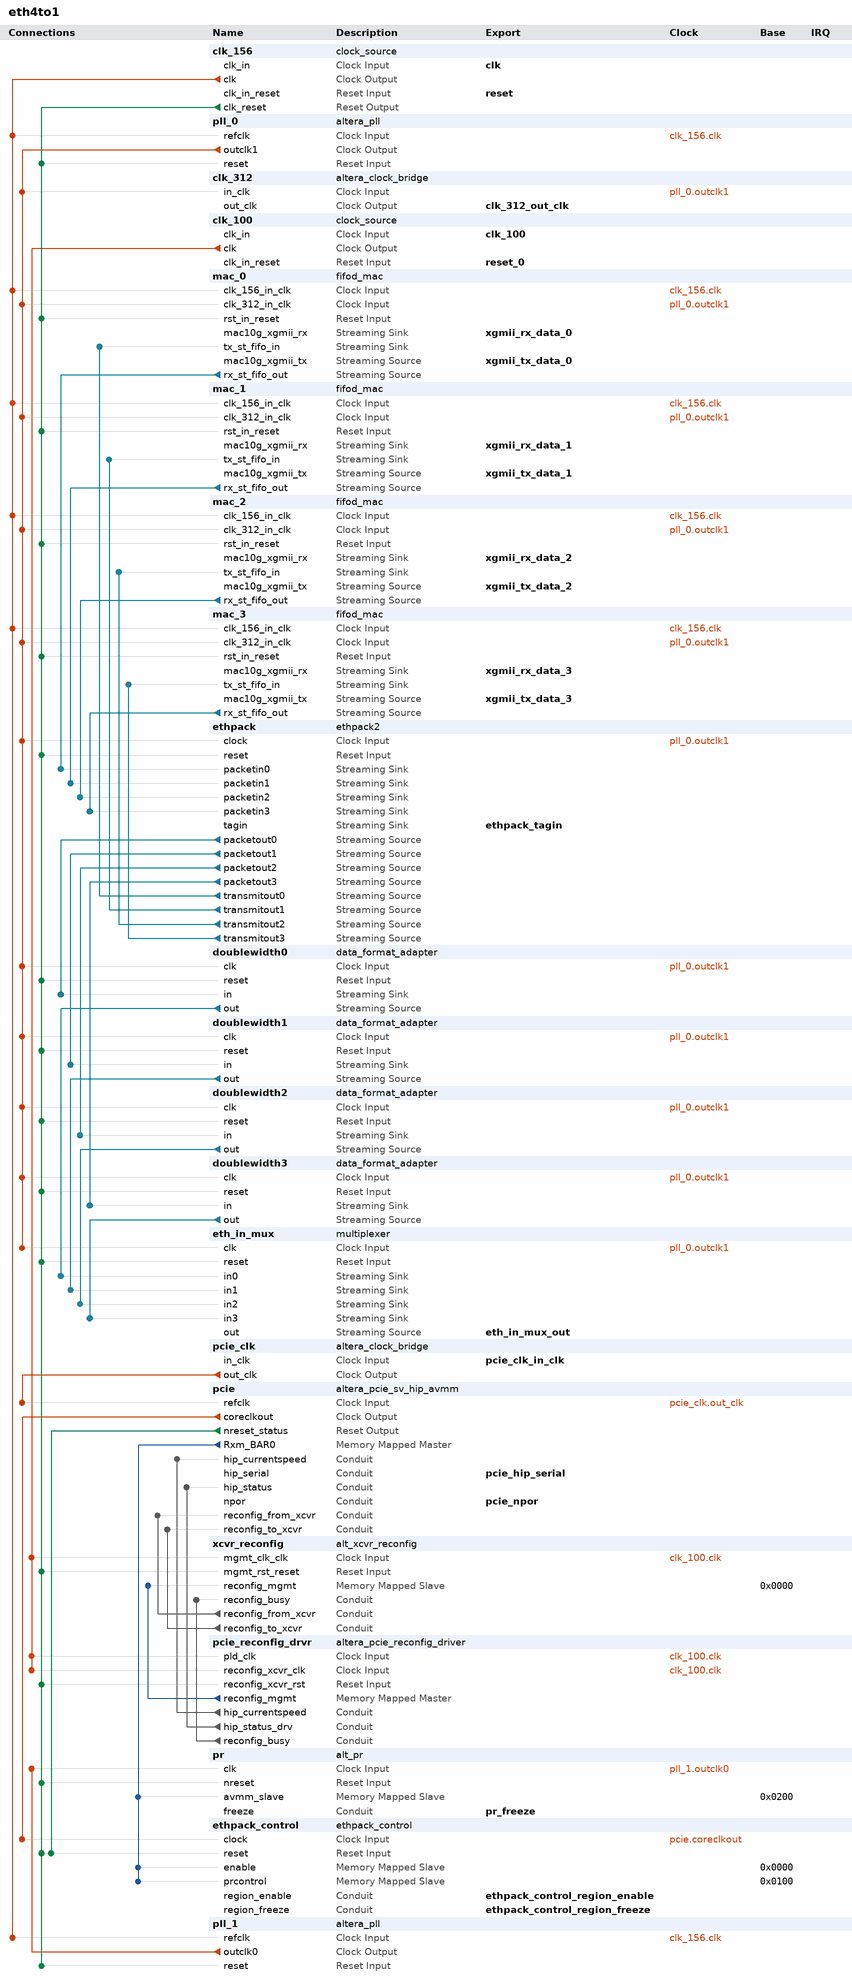
[diagram p0: system contents]
# Platform Designer (Qsys) system eth4to1, Stratix V 5SGXEA7N2F45C2
# Parameters at their usual value, and those the tool derives, are not listed.
package require -exact qsys 16.1
create_system eth4to1
set_project_property DEVICE_FAMILY {Stratix V}
set_project_property DEVICE 5SGXEA7N2F45C2

add_instance clk_156 clock_source 16.1
set_instance_parameter_value clk_156 clockFrequency 156250000

add_instance pll_0 altera_pll 16.1
set_instance_parameter_value pll_0 gui_actual_output_clock_frequency0 {262.910227 MHz}
set_instance_parameter_value pll_0 gui_actual_output_clock_frequency1 {260.416666 MHz}
set_instance_parameter_value pll_0 gui_device_speed_grade 1
set_instance_parameter_value pll_0 gui_number_of_clocks 2
set_instance_parameter_value pll_0 gui_operation_mode direct
set_instance_parameter_value pll_0 gui_output_clock_frequency0 312.5
set_instance_parameter_value pll_0 gui_output_clock_frequency1 260.416666
set_instance_parameter_value pll_0 gui_pll_auto_reset On
set_instance_parameter_value pll_0 gui_pll_mode {Integer-N PLL}
set_instance_parameter_value pll_0 gui_reference_clock_frequency 156.25
set_instance_parameter_value pll_0 gui_use_locked false

add_instance clk_312 altera_clock_bridge 16.1
set_instance_parameter_value clk_312 DERIVED_CLOCK_RATE 260416666
set_instance_parameter_value clk_312 EXPLICIT_CLOCK_RATE 312500000

add_instance clk_100 clock_source 16.1
set_instance_parameter_value clk_100 clockFrequency 100000000

add_instance mac_0 fifod_mac 1.0

add_instance mac_1 fifod_mac 1.0

add_instance mac_2 fifod_mac 1.0

add_instance mac_3 fifod_mac 1.0

add_instance ethpack ethpack2 1.1

add_instance doublewidth0 data_format_adapter 16.1
set_instance_parameter_value doublewidth0 inBitsPerSymbol 74
set_instance_parameter_value doublewidth0 inChannelWidth 0
set_instance_parameter_value doublewidth0 inErrorWidth 0
set_instance_parameter_value doublewidth0 inMaxChannel 0
set_instance_parameter_value doublewidth0 inReadyLatency 0
set_instance_parameter_value doublewidth0 inSymbolsPerBeat 1
set_instance_parameter_value doublewidth0 inUseEmpty false
set_instance_parameter_value doublewidth0 inUseEmptyPort AUTO
set_instance_parameter_value doublewidth0 inUsePackets true
set_instance_parameter_value doublewidth0 outSymbolsPerBeat 2
set_instance_parameter_value doublewidth0 outUseEmpty false
set_instance_parameter_value doublewidth0 outUseEmptyPort AUTO

add_instance doublewidth1 data_format_adapter 16.1
set_instance_parameter_value doublewidth1 inBitsPerSymbol 74
set_instance_parameter_value doublewidth1 inChannelWidth 0
set_instance_parameter_value doublewidth1 inErrorWidth 0
set_instance_parameter_value doublewidth1 inMaxChannel 0
set_instance_parameter_value doublewidth1 inReadyLatency 0
set_instance_parameter_value doublewidth1 inSymbolsPerBeat 1
set_instance_parameter_value doublewidth1 inUseEmpty false
set_instance_parameter_value doublewidth1 inUseEmptyPort AUTO
set_instance_parameter_value doublewidth1 inUsePackets true
set_instance_parameter_value doublewidth1 outSymbolsPerBeat 2
set_instance_parameter_value doublewidth1 outUseEmpty false
set_instance_parameter_value doublewidth1 outUseEmptyPort AUTO

add_instance doublewidth2 data_format_adapter 16.1
set_instance_parameter_value doublewidth2 inBitsPerSymbol 74
set_instance_parameter_value doublewidth2 inChannelWidth 0
set_instance_parameter_value doublewidth2 inErrorWidth 0
set_instance_parameter_value doublewidth2 inMaxChannel 0
set_instance_parameter_value doublewidth2 inReadyLatency 0
set_instance_parameter_value doublewidth2 inSymbolsPerBeat 1
set_instance_parameter_value doublewidth2 inUseEmpty false
set_instance_parameter_value doublewidth2 inUseEmptyPort AUTO
set_instance_parameter_value doublewidth2 inUsePackets true
set_instance_parameter_value doublewidth2 outSymbolsPerBeat 2
set_instance_parameter_value doublewidth2 outUseEmpty false
set_instance_parameter_value doublewidth2 outUseEmptyPort AUTO

add_instance doublewidth3 data_format_adapter 16.1
set_instance_parameter_value doublewidth3 inBitsPerSymbol 74
set_instance_parameter_value doublewidth3 inChannelWidth 0
set_instance_parameter_value doublewidth3 inErrorWidth 0
set_instance_parameter_value doublewidth3 inMaxChannel 0
set_instance_parameter_value doublewidth3 inReadyLatency 0
set_instance_parameter_value doublewidth3 inSymbolsPerBeat 1
set_instance_parameter_value doublewidth3 inUseEmpty false
set_instance_parameter_value doublewidth3 inUseEmptyPort AUTO
set_instance_parameter_value doublewidth3 inUsePackets true
set_instance_parameter_value doublewidth3 outSymbolsPerBeat 2
set_instance_parameter_value doublewidth3 outUseEmpty false
set_instance_parameter_value doublewidth3 outUseEmptyPort AUTO

add_instance eth_in_mux multiplexer 16.1
set_instance_parameter_value eth_in_mux bitsPerSymbol 74
set_instance_parameter_value eth_in_mux errorWidth 0
set_instance_parameter_value eth_in_mux numInputInterfaces 4
set_instance_parameter_value eth_in_mux outChannelWidth 2
set_instance_parameter_value eth_in_mux packetScheduling true
set_instance_parameter_value eth_in_mux schedulingSize 2
set_instance_parameter_value eth_in_mux symbolsPerBeat 2
set_instance_parameter_value eth_in_mux useHighBitsOfChannel true
set_instance_parameter_value eth_in_mux usePackets true

add_instance pcie_clk altera_clock_bridge 16.1
set_instance_parameter_value pcie_clk DERIVED_CLOCK_RATE 0
set_instance_parameter_value pcie_clk EXPLICIT_CLOCK_RATE 100000000

add_instance pcie altera_pcie_sv_hip_avmm 16.1
set_instance_parameter_value pcie AST_LITE 0
set_instance_parameter_value pcie AVALON_ADDR_WIDTH 32
set_instance_parameter_value pcie AddressPage "0\\,1\\,2\\,3\\,4\\,5\\,6\\,7\\,8\\,9\\,10\\,11\\,12\\,13\\,14\\,15"
set_instance_parameter_value pcie BYPASSS_A2P_TRANSLATION 0
set_instance_parameter_value pcie CB_A2P_ADDR_MAP_FIXED_TABLE_0_HIGH 0
set_instance_parameter_value pcie CB_A2P_ADDR_MAP_FIXED_TABLE_0_LOW 0
set_instance_parameter_value pcie CB_A2P_ADDR_MAP_FIXED_TABLE_10_HIGH 0
set_instance_parameter_value pcie CB_A2P_ADDR_MAP_FIXED_TABLE_10_LOW 0
set_instance_parameter_value pcie CB_A2P_ADDR_MAP_FIXED_TABLE_11_HIGH 0
set_instance_parameter_value pcie CB_A2P_ADDR_MAP_FIXED_TABLE_11_LOW 0
set_instance_parameter_value pcie CB_A2P_ADDR_MAP_FIXED_TABLE_12_HIGH 0
set_instance_parameter_value pcie CB_A2P_ADDR_MAP_FIXED_TABLE_12_LOW 0
set_instance_parameter_value pcie CB_A2P_ADDR_MAP_FIXED_TABLE_13_HIGH 0
set_instance_parameter_value pcie CB_A2P_ADDR_MAP_FIXED_TABLE_13_LOW 0
set_instance_parameter_value pcie CB_A2P_ADDR_MAP_FIXED_TABLE_14_HIGH 0
set_instance_parameter_value pcie CB_A2P_ADDR_MAP_FIXED_TABLE_14_LOW 0
set_instance_parameter_value pcie CB_A2P_ADDR_MAP_FIXED_TABLE_15_HIGH 0
set_instance_parameter_value pcie CB_A2P_ADDR_MAP_FIXED_TABLE_15_LOW 0
set_instance_parameter_value pcie CB_A2P_ADDR_MAP_FIXED_TABLE_1_HIGH 0
set_instance_parameter_value pcie CB_A2P_ADDR_MAP_FIXED_TABLE_1_LOW 0
set_instance_parameter_value pcie CB_A2P_ADDR_MAP_FIXED_TABLE_2_HIGH 0
set_instance_parameter_value pcie CB_A2P_ADDR_MAP_FIXED_TABLE_2_LOW 0
set_instance_parameter_value pcie CB_A2P_ADDR_MAP_FIXED_TABLE_3_HIGH 0
set_instance_parameter_value pcie CB_A2P_ADDR_MAP_FIXED_TABLE_3_LOW 0
set_instance_parameter_value pcie CB_A2P_ADDR_MAP_FIXED_TABLE_4_HIGH 0
set_instance_parameter_value pcie CB_A2P_ADDR_MAP_FIXED_TABLE_4_LOW 0
set_instance_parameter_value pcie CB_A2P_ADDR_MAP_FIXED_TABLE_5_HIGH 0
set_instance_parameter_value pcie CB_A2P_ADDR_MAP_FIXED_TABLE_5_LOW 0
set_instance_parameter_value pcie CB_A2P_ADDR_MAP_FIXED_TABLE_6_HIGH 0
set_instance_parameter_value pcie CB_A2P_ADDR_MAP_FIXED_TABLE_6_LOW 0
set_instance_parameter_value pcie CB_A2P_ADDR_MAP_FIXED_TABLE_7_HIGH 0
set_instance_parameter_value pcie CB_A2P_ADDR_MAP_FIXED_TABLE_7_LOW 0
set_instance_parameter_value pcie CB_A2P_ADDR_MAP_FIXED_TABLE_8_HIGH 0
set_instance_parameter_value pcie CB_A2P_ADDR_MAP_FIXED_TABLE_8_LOW 0
set_instance_parameter_value pcie CB_A2P_ADDR_MAP_FIXED_TABLE_9_HIGH 0
set_instance_parameter_value pcie CB_A2P_ADDR_MAP_FIXED_TABLE_9_LOW 0
set_instance_parameter_value pcie CB_A2P_ADDR_MAP_IS_FIXED 0
set_instance_parameter_value pcie CB_A2P_ADDR_MAP_NUM_ENTRIES 2
set_instance_parameter_value pcie CB_A2P_ADDR_MAP_PASS_THRU_BITS 20
set_instance_parameter_value pcie CB_P2A_AVALON_ADDR_B0 0x00000000
set_instance_parameter_value pcie CB_P2A_AVALON_ADDR_B1 0x00000000
set_instance_parameter_value pcie CB_P2A_AVALON_ADDR_B2 0x00000000
set_instance_parameter_value pcie CB_P2A_AVALON_ADDR_B3 0x00000000
set_instance_parameter_value pcie CB_P2A_AVALON_ADDR_B4 0x00000000
set_instance_parameter_value pcie CB_P2A_AVALON_ADDR_B5 0x00000000
set_instance_parameter_value pcie CB_P2A_FIXED_AVALON_ADDR_B0 0
set_instance_parameter_value pcie CB_P2A_FIXED_AVALON_ADDR_B1 0
set_instance_parameter_value pcie CB_P2A_FIXED_AVALON_ADDR_B2 0
set_instance_parameter_value pcie CB_P2A_FIXED_AVALON_ADDR_B3 0
set_instance_parameter_value pcie CB_P2A_FIXED_AVALON_ADDR_B4 0
set_instance_parameter_value pcie CB_P2A_FIXED_AVALON_ADDR_B5 0
set_instance_parameter_value pcie CB_PCIE_MODE 0
set_instance_parameter_value pcie CB_PCIE_RX_LITE 0
set_instance_parameter_value pcie CB_RP_S_ADDR_WIDTH 32
set_instance_parameter_value pcie CG_COMMON_CLOCK_MODE 1
set_instance_parameter_value pcie CG_ENABLE_A2P_INTERRUPT 0
set_instance_parameter_value pcie CG_ENABLE_ADVANCED_INTERRUPT 0
set_instance_parameter_value pcie CG_ENABLE_HIP_STATUS 1
set_instance_parameter_value pcie CG_ENABLE_HIP_STATUS_EXTENSION 0
set_instance_parameter_value pcie CG_IMPL_CRA_AV_SLAVE_PORT 1
set_instance_parameter_value pcie CG_RXM_IRQ_NUM 16
set_instance_parameter_value pcie NUM_PREFETCH_MASTERS 1
set_instance_parameter_value pcie PCIeAddress31_0 "0x00000000\\,0x00000000\\,0x00000000\\,0x00000000\\,0x00000000\\,0x00000000\\,0x00000000\\,0x00000000\\,0x00000000\\,0x00000000\\,0x00000000\\,0x00000000\\,0x00000000\\,0x00000000\\,0x00000000\\,0x00000000"
set_instance_parameter_value pcie PCIeAddress63_32 "0x00000000\\,0x00000000\\,0x00000000\\,0x00000000\\,0x00000000\\,0x00000000\\,0x00000000\\,0x00000000\\,0x00000000\\,0x00000000\\,0x00000000\\,0x00000000\\,0x00000000\\,0x00000000\\,0x00000000\\,0x00000000"
set_instance_parameter_value pcie RXM_BEN_WIDTH 8
set_instance_parameter_value pcie RXM_DATA_WIDTH 64
set_instance_parameter_value pcie SLAVE_ADDRESS_MAP_0 10
set_instance_parameter_value pcie SLAVE_ADDRESS_MAP_1 0
set_instance_parameter_value pcie SLAVE_ADDRESS_MAP_2 0
set_instance_parameter_value pcie SLAVE_ADDRESS_MAP_3 0
set_instance_parameter_value pcie SLAVE_ADDRESS_MAP_4 0
set_instance_parameter_value pcie SLAVE_ADDRESS_MAP_5 0
set_instance_parameter_value pcie TX_S_ADDR_WIDTH 32
set_instance_parameter_value pcie advanced_default_hwtcl_atomic_malformed true
set_instance_parameter_value pcie advanced_default_hwtcl_atomic_op_completer_32bit false
set_instance_parameter_value pcie advanced_default_hwtcl_atomic_op_completer_64bit false
set_instance_parameter_value pcie advanced_default_hwtcl_atomic_op_routing false
set_instance_parameter_value pcie advanced_default_hwtcl_bridge_port_ssid_support false
set_instance_parameter_value pcie advanced_default_hwtcl_bridge_port_vga_enable false
set_instance_parameter_value pcie advanced_default_hwtcl_bypass_cdc false
set_instance_parameter_value pcie advanced_default_hwtcl_cas_completer_128bit false
set_instance_parameter_value pcie advanced_default_hwtcl_cdc_dummy_insert_limit 11
set_instance_parameter_value pcie advanced_default_hwtcl_d0_pme false
set_instance_parameter_value pcie advanced_default_hwtcl_d1_pme false
set_instance_parameter_value pcie advanced_default_hwtcl_d1_support false
set_instance_parameter_value pcie advanced_default_hwtcl_d2_pme false
set_instance_parameter_value pcie advanced_default_hwtcl_d2_support false
set_instance_parameter_value pcie advanced_default_hwtcl_d3_cold_pme false
set_instance_parameter_value pcie advanced_default_hwtcl_d3_hot_pme false
set_instance_parameter_value pcie advanced_default_hwtcl_data_pack_rx disable
set_instance_parameter_value pcie advanced_default_hwtcl_deskew_comma com_deskw
set_instance_parameter_value pcie advanced_default_hwtcl_device_number 0
set_instance_parameter_value pcie advanced_default_hwtcl_disable_link_x2_support false
set_instance_parameter_value pcie advanced_default_hwtcl_disable_snoop_packet false
set_instance_parameter_value pcie advanced_default_hwtcl_ei_delay_powerdown_count 10
set_instance_parameter_value pcie advanced_default_hwtcl_eie_before_nfts_count 4
set_instance_parameter_value pcie advanced_default_hwtcl_enable_adapter_half_rate_mode false
set_instance_parameter_value pcie advanced_default_hwtcl_enable_l1_aspm false
set_instance_parameter_value pcie advanced_default_hwtcl_enable_rx_buffer_checking false
set_instance_parameter_value pcie advanced_default_hwtcl_extended_format_field false
set_instance_parameter_value pcie advanced_default_hwtcl_extended_tag_reset false
set_instance_parameter_value pcie advanced_default_hwtcl_fc_init_timer 1024
set_instance_parameter_value pcie advanced_default_hwtcl_flow_control_timeout_count 200
set_instance_parameter_value pcie advanced_default_hwtcl_flow_control_update_count 30
set_instance_parameter_value pcie advanced_default_hwtcl_flr_capability false
set_instance_parameter_value pcie advanced_default_hwtcl_gen2_diffclock_nfts_count 255
set_instance_parameter_value pcie advanced_default_hwtcl_gen2_sameclock_nfts_count 255
set_instance_parameter_value pcie advanced_default_hwtcl_hot_plug_support 0
set_instance_parameter_value pcie advanced_default_hwtcl_interrupt_pin inta
set_instance_parameter_value pcie advanced_default_hwtcl_l01_entry_latency 31
set_instance_parameter_value pcie advanced_default_hwtcl_l0_exit_latency_diffclock 6
set_instance_parameter_value pcie advanced_default_hwtcl_l0_exit_latency_sameclock 6
set_instance_parameter_value pcie advanced_default_hwtcl_l1_exit_latency_diffclock 0
set_instance_parameter_value pcie advanced_default_hwtcl_l1_exit_latency_sameclock 0
set_instance_parameter_value pcie advanced_default_hwtcl_low_priority_vc single_vc
set_instance_parameter_value pcie advanced_default_hwtcl_ltr_mechanism false
set_instance_parameter_value pcie advanced_default_hwtcl_ltssm_1ms_timeout disable
set_instance_parameter_value pcie advanced_default_hwtcl_ltssm_freqlocked_check disable
set_instance_parameter_value pcie advanced_default_hwtcl_maximum_current 0
set_instance_parameter_value pcie advanced_default_hwtcl_no_command_completed false
set_instance_parameter_value pcie advanced_default_hwtcl_no_soft_reset false
set_instance_parameter_value pcie advanced_default_hwtcl_pclk_out_sel pclk
set_instance_parameter_value pcie advanced_default_hwtcl_pipex1_debug_sel disable
set_instance_parameter_value pcie advanced_default_hwtcl_register_pipe_signals false
set_instance_parameter_value pcie advanced_default_hwtcl_reserved_debug 0
set_instance_parameter_value pcie advanced_default_hwtcl_retry_buffer_last_active_address 2047
set_instance_parameter_value pcie advanced_default_hwtcl_rx_l0s_count_idl 0
set_instance_parameter_value pcie advanced_default_hwtcl_set_l0s 0
set_instance_parameter_value pcie advanced_default_hwtcl_skp_os_gen3_count 0
set_instance_parameter_value pcie advanced_default_hwtcl_skp_os_schedule_count 0
set_instance_parameter_value pcie advanced_default_hwtcl_ssid 0
set_instance_parameter_value pcie advanced_default_hwtcl_ssvid 0
set_instance_parameter_value pcie advanced_default_hwtcl_tph_completer false
set_instance_parameter_value pcie advanced_default_hwtcl_tx_cdc_almost_empty 5
set_instance_parameter_value pcie advanced_default_hwtcl_vc0_clk_enable true
set_instance_parameter_value pcie advanced_default_hwtcl_wrong_device_id disable
set_instance_parameter_value pcie advanced_default_parameter_override 0
set_instance_parameter_value pcie avmm_width_hwtcl 128
set_instance_parameter_value pcie bar0_type_hwtcl 1
set_instance_parameter_value pcie bar1_type_hwtcl 0
set_instance_parameter_value pcie bar2_type_hwtcl 1
set_instance_parameter_value pcie bar3_type_hwtcl 0
set_instance_parameter_value pcie bar4_type_hwtcl 0
set_instance_parameter_value pcie bar5_type_hwtcl 0
set_instance_parameter_value pcie bypass_tl false
set_instance_parameter_value pcie class_code_hwtcl 16711680
set_instance_parameter_value pcie completion_timeout_hwtcl ABCD
set_instance_parameter_value pcie device_id_hwtcl 57599
set_instance_parameter_value pcie dll_active_report_support_hwtcl 0
set_instance_parameter_value pcie ecrc_check_capable_hwtcl 0
set_instance_parameter_value pcie ecrc_gen_capable_hwtcl 0
set_instance_parameter_value pcie enable_completion_timeout_disable_hwtcl 1
set_instance_parameter_value pcie enable_function_msix_support_hwtcl 0
set_instance_parameter_value pcie enable_pcisigtest_hwtcl 0
set_instance_parameter_value pcie enable_power_on_rst_pulse_hwtcl 0
set_instance_parameter_value pcie enable_slot_register_hwtcl 0
set_instance_parameter_value pcie enable_tl_only_sim_hwtcl 0
set_instance_parameter_value pcie endpoint_l0_latency_hwtcl 0
set_instance_parameter_value pcie endpoint_l1_latency_hwtcl 0
set_instance_parameter_value pcie expansion_base_address_register_hwtcl 0
set_instance_parameter_value pcie extend_tag_field_hwtcl 32
set_instance_parameter_value pcie fixed_address_mode 0
set_instance_parameter_value pcie force_hrc 0
set_instance_parameter_value pcie force_src 0
set_instance_parameter_value pcie gen123_lane_rate_mode_hwtcl {Gen2 (5.0 Gbps)}
set_instance_parameter_value pcie gen3_rxfreqlock_counter_hwtcl 0
set_instance_parameter_value pcie hip_reconfig_hwtcl 0
set_instance_parameter_value pcie hip_tag_checking_hwtcl 1
set_instance_parameter_value pcie hwtcl_override_g2_txvod 1
set_instance_parameter_value pcie in_cvp_mode_hwtcl 0
set_instance_parameter_value pcie io_window_addr_width_hwtcl 0
set_instance_parameter_value pcie lane_mask_hwtcl x8
set_instance_parameter_value pcie max_payload_size_hwtcl 128
set_instance_parameter_value pcie msi_64bit_addressing_capable_hwtcl true
set_instance_parameter_value pcie msi_masking_capable_hwtcl false
set_instance_parameter_value pcie msi_multi_message_capable_hwtcl 4
set_instance_parameter_value pcie msi_support_hwtcl true
set_instance_parameter_value pcie msix_pba_bir_hwtcl 0
set_instance_parameter_value pcie msix_pba_offset_hwtcl 0
set_instance_parameter_value pcie msix_table_bir_hwtcl 0
set_instance_parameter_value pcie msix_table_offset_hwtcl 0
set_instance_parameter_value pcie msix_table_size_hwtcl 0
set_instance_parameter_value pcie override_rxbuffer_cred_preset 0
set_instance_parameter_value pcie override_tbpartner_driver_setting_hwtcl 0
set_instance_parameter_value pcie pcie_inspector_hwtcl 0
set_instance_parameter_value pcie pcie_qsys 1
set_instance_parameter_value pcie pll_refclk_freq_hwtcl {100 MHz}
set_instance_parameter_value pcie port_link_number_hwtcl 1
set_instance_parameter_value pcie port_type_hwtcl {Native endpoint}
set_instance_parameter_value pcie prefetchable_mem_window_addr_width_hwtcl 0
set_instance_parameter_value pcie revision_id_hwtcl 1
set_instance_parameter_value pcie rpre_emph_a_val_hwtcl 9
set_instance_parameter_value pcie rpre_emph_b_val_hwtcl 0
set_instance_parameter_value pcie rpre_emph_c_val_hwtcl 16
set_instance_parameter_value pcie rpre_emph_d_val_hwtcl 13
set_instance_parameter_value pcie rpre_emph_e_val_hwtcl 5
set_instance_parameter_value pcie rvod_sel_a_val_hwtcl 42
set_instance_parameter_value pcie rvod_sel_b_val_hwtcl 38
set_instance_parameter_value pcie rvod_sel_c_val_hwtcl 38
set_instance_parameter_value pcie rvod_sel_d_val_hwtcl 43
set_instance_parameter_value pcie rvod_sel_e_val_hwtcl 15
set_instance_parameter_value pcie rxbuffer_rxreq_hwtcl Low
set_instance_parameter_value pcie serial_sim_hwtcl 1
set_instance_parameter_value pcie set_pld_clk_x1_625MHz_hwtcl 0
set_instance_parameter_value pcie slot_number_hwtcl 0
set_instance_parameter_value pcie slot_power_limit_hwtcl 0
set_instance_parameter_value pcie slot_power_scale_hwtcl 0
set_instance_parameter_value pcie slotclkcfg_hwtcl 1
set_instance_parameter_value pcie subsystem_device_id_hwtcl 57599
set_instance_parameter_value pcie subsystem_vendor_id_hwtcl 4466
set_instance_parameter_value pcie surprise_down_error_support_hwtcl 0
set_instance_parameter_value pcie tlp_insp_trg_dw0_hwtcl 2049
set_instance_parameter_value pcie tlp_insp_trg_dw1_hwtcl 0
set_instance_parameter_value pcie tlp_insp_trg_dw2_hwtcl 0
set_instance_parameter_value pcie tlp_insp_trg_dw3_hwtcl 0
set_instance_parameter_value pcie tlp_inspector_hwtcl 0
set_instance_parameter_value pcie tlp_inspector_use_signal_probe_hwtcl 0
set_instance_parameter_value pcie use_aer_hwtcl 0
set_instance_parameter_value pcie use_ast_parity 0
set_instance_parameter_value pcie use_atx_pll_hwtcl 0
set_instance_parameter_value pcie use_crc_forwarding_hwtcl 0
set_instance_parameter_value pcie use_cvp_update_core_pof_hwtcl 0
set_instance_parameter_value pcie use_rx_st_be_hwtcl 0
set_instance_parameter_value pcie user_id_hwtcl 0
set_instance_parameter_value pcie vendor_id_hwtcl 4466
set_instance_parameter_value pcie vsec_id_hwtcl 4466
set_instance_parameter_value pcie vsec_rev_hwtcl 0

add_instance xcvr_reconfig alt_xcvr_reconfig 16.1
set_instance_parameter_value xcvr_reconfig device_family {Stratix V}
set_instance_parameter_value xcvr_reconfig enable_adce 0
set_instance_parameter_value xcvr_reconfig enable_analog 1
set_instance_parameter_value xcvr_reconfig number_of_reconfig_interfaces 10

add_instance pcie_reconfig_drvr altera_pcie_reconfig_driver 16.1
set_instance_parameter_value pcie_reconfig_drvr gen123_lane_rate_mode_hwtcl {Gen3 (8.0 Gbps)}
set_instance_parameter_value pcie_reconfig_drvr number_of_reconfig_interfaces 11

add_instance pr alt_pr 16.1
set_instance_parameter_value pr CDRATIO 1
set_instance_parameter_value pr DATA_WIDTH_INDEX 32
set_instance_parameter_value pr EDCRC_OSC_DIVIDER 1
set_instance_parameter_value pr ENABLE_AVMM_SLAVE true
set_instance_parameter_value pr ENABLE_ENHANCED_DECOMPRESSION false
set_instance_parameter_value pr ENABLE_INTERRUPT false
set_instance_parameter_value pr ENABLE_JTAG true
set_instance_parameter_value pr ENABLE_PRPOF_ID_CHECK_UI false
set_instance_parameter_value pr EXT_HOST_PRPOF_ID 0
set_instance_parameter_value pr EXT_HOST_TARGET_DEVICE_FAMILY {Stratix V}
set_instance_parameter_value pr GENERATE_SDC true
set_instance_parameter_value pr INSTANTIATE_CRC_BLOCK true
set_instance_parameter_value pr INSTANTIATE_PR_BLOCK true
set_instance_parameter_value pr PR_INTERNAL_HOST true

add_instance ethpack_control ethpack_control 1.0
set_instance_parameter_value ethpack_control REGIONDEFAULT 3

add_instance pll_1 altera_pll 16.1
set_instance_parameter_value pll_1 gui_actual_output_clock_frequency0 {99.997368 MHz}
set_instance_parameter_value pll_1 gui_device_speed_grade 1
set_instance_parameter_value pll_1 gui_number_of_clocks 1
set_instance_parameter_value pll_1 gui_operation_mode direct
set_instance_parameter_value pll_1 gui_output_clock_frequency0 100.0
set_instance_parameter_value pll_1 gui_pll_mode {Integer-N PLL}
set_instance_parameter_value pll_1 gui_reference_clock_frequency 156.25
set_instance_parameter_value pll_1 gui_use_locked false

# connections
add_connection clk_100.clk pcie_reconfig_drvr.pld_clk clock
add_connection clk_100.clk pcie_reconfig_drvr.reconfig_xcvr_clk clock
add_connection clk_100.clk xcvr_reconfig.mgmt_clk_clk clock
add_connection clk_156.clk mac_0.clk_156_in_clk clock
add_connection clk_156.clk mac_1.clk_156_in_clk clock
add_connection clk_156.clk mac_2.clk_156_in_clk clock
add_connection clk_156.clk mac_3.clk_156_in_clk clock
add_connection clk_156.clk pll_0.refclk clock
add_connection clk_156.clk pll_1.refclk clock
add_connection pcie.coreclkout ethpack_control.clock clock
add_connection pcie_clk.out_clk pcie.refclk clock
add_connection pll_0.outclk1 clk_312.in_clk clock
add_connection pll_0.outclk1 doublewidth0.clk clock
add_connection pll_0.outclk1 doublewidth1.clk clock
add_connection pll_0.outclk1 doublewidth2.clk clock
add_connection pll_0.outclk1 doublewidth3.clk clock
add_connection pll_0.outclk1 eth_in_mux.clk clock
add_connection pll_0.outclk1 ethpack.clock clock
add_connection pll_0.outclk1 mac_0.clk_312_in_clk clock
add_connection pll_0.outclk1 mac_1.clk_312_in_clk clock
add_connection pll_0.outclk1 mac_2.clk_312_in_clk clock
add_connection pll_0.outclk1 mac_3.clk_312_in_clk clock
add_connection pll_1.outclk0 pr.clk clock
add_connection clk_156.clk_reset doublewidth0.reset reset
add_connection clk_156.clk_reset doublewidth1.reset reset
add_connection clk_156.clk_reset doublewidth2.reset reset
add_connection clk_156.clk_reset doublewidth3.reset reset
add_connection clk_156.clk_reset eth_in_mux.reset reset
add_connection clk_156.clk_reset ethpack.reset reset
add_connection clk_156.clk_reset ethpack_control.reset reset
add_connection clk_156.clk_reset mac_0.rst_in_reset reset
add_connection clk_156.clk_reset mac_1.rst_in_reset reset
add_connection clk_156.clk_reset mac_2.rst_in_reset reset
add_connection clk_156.clk_reset mac_3.rst_in_reset reset
add_connection clk_156.clk_reset pcie_reconfig_drvr.reconfig_xcvr_rst reset
add_connection clk_156.clk_reset pll_0.reset reset
add_connection clk_156.clk_reset pll_1.reset reset
add_connection clk_156.clk_reset pr.nreset reset
add_connection clk_156.clk_reset xcvr_reconfig.mgmt_rst_reset reset
add_connection pcie.nreset_status ethpack_control.reset reset
add_connection pcie.Rxm_BAR0 ethpack_control.enable avalon
set_connection_parameter_value pcie.Rxm_BAR0/ethpack_control.enable baseAddress 0x0000
add_connection pcie.Rxm_BAR0 ethpack_control.prcontrol avalon
set_connection_parameter_value pcie.Rxm_BAR0/ethpack_control.prcontrol baseAddress 0x0100
add_connection pcie.Rxm_BAR0 pr.avmm_slave avalon
set_connection_parameter_value pcie.Rxm_BAR0/pr.avmm_slave baseAddress 0x0200
add_connection pcie_reconfig_drvr.reconfig_mgmt xcvr_reconfig.reconfig_mgmt avalon
set_connection_parameter_value pcie_reconfig_drvr.reconfig_mgmt/xcvr_reconfig.reconfig_mgmt baseAddress 0x0000
add_connection doublewidth0.out eth_in_mux.in0 avalon_streaming
add_connection doublewidth1.out eth_in_mux.in1 avalon_streaming
add_connection doublewidth2.out eth_in_mux.in2 avalon_streaming
add_connection doublewidth3.out eth_in_mux.in3 avalon_streaming
add_connection ethpack.packetout0 doublewidth0.in avalon_streaming
add_connection ethpack.packetout1 doublewidth1.in avalon_streaming
add_connection ethpack.packetout2 doublewidth2.in avalon_streaming
add_connection ethpack.packetout3 doublewidth3.in avalon_streaming
add_connection ethpack.transmitout0 mac_0.tx_st_fifo_in avalon_streaming
add_connection ethpack.transmitout1 mac_1.tx_st_fifo_in avalon_streaming
add_connection ethpack.transmitout2 mac_2.tx_st_fifo_in avalon_streaming
add_connection ethpack.transmitout3 mac_3.tx_st_fifo_in avalon_streaming
add_connection mac_0.rx_st_fifo_out ethpack.packetin0 avalon_streaming
add_connection mac_1.rx_st_fifo_out ethpack.packetin1 avalon_streaming
add_connection mac_2.rx_st_fifo_out ethpack.packetin2 avalon_streaming
add_connection mac_3.rx_st_fifo_out ethpack.packetin3 avalon_streaming
add_connection pcie_reconfig_drvr.hip_currentspeed pcie.hip_currentspeed conduit
add_connection pcie_reconfig_drvr.hip_status_drv pcie.hip_status conduit
add_connection pcie_reconfig_drvr.reconfig_busy xcvr_reconfig.reconfig_busy conduit
add_connection xcvr_reconfig.reconfig_from_xcvr pcie.reconfig_from_xcvr conduit
add_connection xcvr_reconfig.reconfig_to_xcvr pcie.reconfig_to_xcvr conduit

# exported interfaces
add_interface clk clock sink
set_interface_property clk EXPORT_OF clk_156.clk_in
add_interface clk_100 clock sink
set_interface_property clk_100 EXPORT_OF clk_100.clk_in
add_interface clk_312_out_clk clock source
set_interface_property clk_312_out_clk EXPORT_OF clk_312.out_clk
add_interface eth_in_mux_out avalon_streaming source
set_interface_property eth_in_mux_out EXPORT_OF eth_in_mux.out
add_interface ethpack_control_region_enable conduit end
set_interface_property ethpack_control_region_enable EXPORT_OF ethpack_control.region_enable
add_interface ethpack_control_region_freeze conduit end
set_interface_property ethpack_control_region_freeze EXPORT_OF ethpack_control.region_freeze
add_interface ethpack_tagin avalon_streaming sink
set_interface_property ethpack_tagin EXPORT_OF ethpack.tagin
add_interface pcie_clk_in_clk clock sink
set_interface_property pcie_clk_in_clk EXPORT_OF pcie_clk.in_clk
add_interface pcie_hip_serial conduit end
set_interface_property pcie_hip_serial EXPORT_OF pcie.hip_serial
add_interface pcie_npor conduit end
set_interface_property pcie_npor EXPORT_OF pcie.npor
add_interface pr_freeze conduit end
set_interface_property pr_freeze EXPORT_OF pr.freeze
add_interface reset reset sink
set_interface_property reset EXPORT_OF clk_156.clk_in_reset
add_interface reset_0 reset sink
set_interface_property reset_0 EXPORT_OF clk_100.clk_in_reset
add_interface xgmii_rx_data_0 avalon_streaming sink
set_interface_property xgmii_rx_data_0 EXPORT_OF mac_0.mac10g_xgmii_rx
add_interface xgmii_rx_data_1 avalon_streaming sink
set_interface_property xgmii_rx_data_1 EXPORT_OF mac_1.mac10g_xgmii_rx
add_interface xgmii_rx_data_2 avalon_streaming sink
set_interface_property xgmii_rx_data_2 EXPORT_OF mac_2.mac10g_xgmii_rx
add_interface xgmii_rx_data_3 avalon_streaming sink
set_interface_property xgmii_rx_data_3 EXPORT_OF mac_3.mac10g_xgmii_rx
add_interface xgmii_tx_data_0 avalon_streaming source
set_interface_property xgmii_tx_data_0 EXPORT_OF mac_0.mac10g_xgmii_tx
add_interface xgmii_tx_data_1 avalon_streaming source
set_interface_property xgmii_tx_data_1 EXPORT_OF mac_1.mac10g_xgmii_tx
add_interface xgmii_tx_data_2 avalon_streaming source
set_interface_property xgmii_tx_data_2 EXPORT_OF mac_2.mac10g_xgmii_tx
add_interface xgmii_tx_data_3 avalon_streaming source
set_interface_property xgmii_tx_data_3 EXPORT_OF mac_3.mac10g_xgmii_tx

set_interconnect_requirement {$system} qsys_mm.clockCrossingAdapter HANDSHAKE
set_interconnect_requirement {$system} qsys_mm.enableEccProtection FALSE
set_interconnect_requirement {$system} qsys_mm.insertDefaultSlave FALSE
set_interconnect_requirement {$system} qsys_mm.maxAdditionalLatency 1

save_system eth4to1.qsys
